# Altium schematic sheet DAC To LP Filter.SchDoc: Audio_Moduloop - DAC/LP-filter
size A; Date: 2/27/2024; DrawnBy: Team 28: Ryan Gordon, Conor Curtin, Evan Roveili, Shawn Colby; DocumentNumber: 3; Revision: V1; SheetNumber: 3; SheetTotal: 7
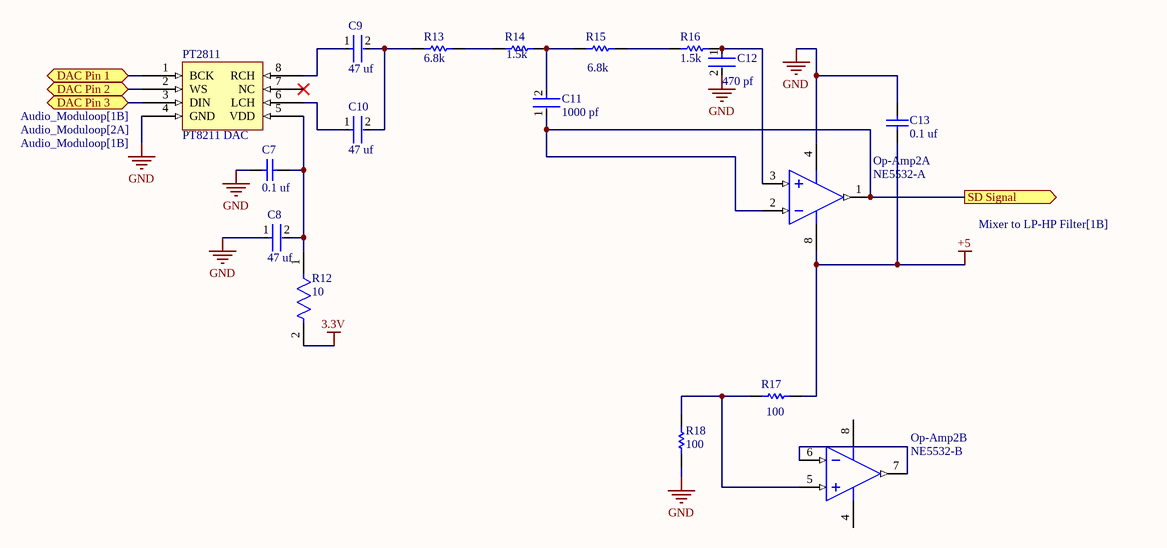
[diagram p0: DAC To LP Filter.SchDoc]

## Parts
C7  0.1 uf  [VISH-K104K15X7RF5TL2]
C8  47 uf  [FP-RCE2A2-MFG]
C9  47 uf  [FP-RCE2A2-MFG]
C10  47 uf  [FP-RCE2A2-MFG]
C11  1000 pf  [FP-VY1102M35Y5UQ6TV0-MFG]
C12  470 pf  [FP-F471K33Y5RP6UK5R-MFG]
C13  0.1 uf  [AVX-SA115C104KAR]
Op-Amp2  NE5532-A  [ONSC-SOIC-8-751-07_V]  (parts A,B of 2)
PT2811  PT8211 DAC  [SOIC127P602X173-8N]
R12  10  [FP-RN732A-MFG]
R13  6.8k  [RESC2013X70X40LL20T20]
R14  1.5k  [RESC2013X60X35LL10T20]
R15  6.8k  [RESC2013X70X40LL20T20]
R16  1.5k  [RESC2013X60X35LL10T20]
R17  100  [RESC2013X60X40ML20T25]
R18  100  [RESC2013X60X40ML20T25]

## Ports
DAC Pin 1 (bidir, see Audio_Moduloop[1B]), DAC Pin 2 (bidir, see Audio_Moduloop[1B]), DAC Pin 3 (bidir, see Audio_Moduloop[2A]), SD Signal (out, see Mixer to LP-HP Filter[1B])

## Nets
3.3V: R12.2
+5: C13.1 Op-Amp2.8(V+) R17.2
GND: C7.2 C8.1 C12.2 C13.2 Op-Amp2.4(V-) PT2811.4(GND) R18.1
DAC Pin 1: PT2811.1(BCK) ; port DAC Pin 1
DAC Pin 2: PT2811.2(WS) ; port DAC Pin 2
DAC Pin 3: PT2811.3(DIN) ; port DAC Pin 3
SD Signal: C11.1 Op-Amp2.1(OUTA) Op-Amp2.2(INA-) ; port SD Signal
NetC7_1: C7.1 C8.2 PT2811.5(VDD) R12.1
NetC9_1: C9.1 PT2811.8(RCH)
NetC9_2: C9.2 C10.2 R13.1
NetC10_1: C10.1 PT2811.6(LCH)
NetC11_2: C11.2 R14.2 R15.1
NetC12_1: C12.1 Op-Amp2.3(INA+) R16.2
NetOp-Amp2_5: Op-Amp2.5(INB+) R17.1 R18.2
NetOp-Amp2_6: Op-Amp2.6(INB-) Op-Amp2.7(OUTB)
NetR13_2: R13.2 R14.1
NetR15_2: R15.2 R16.1

Not connected (* = marked no-connect by the designer): PT2811 7(NC)*

## Notes on the sheet
- Title
- Size
- Date:
- A
- Drawn By:
- Sheet    of
- Revision
- File:
- Document Number:

## Library data of the parts
C7 = CMP-2000-06508-1: Ceramic Capacitor, 100 nF, +/- 10%, 50 V, -55 to 125 degC, 2-Pin THD, RoHS, Tape and Reel; Manufacturer: Vishay; Other Names: BC1084CT; Catalog Drawings: Mono-KapSide2-15_5.58Mono-KapSide1_15; Temperature Coefficient: X7R; Voltage - Rated: 50V; Online Catalog: Mono-Kap™Series; Capacitance: 0.1µF; Size / Dimension: 0.157"Lx0.098"W(4.00mmx2.50mm); Operating Temperature: -55°C~125°C; Family: CeramicCapacitors; Manufacturer URL: http://www.vishay.com/; Standard Package: 1; Thickness (Max): -; Ratings: -; Datasheet Version: 08/2013; Package Description: 2-Pin Through Hole Device, Body 4 x 2.6 mm; Mounting Type: ThroughHole; Features: -; Lead Spacing: 0.098"(2.50mm); Tolerance: ±10%; Category: Capacitors; Mounting Technology: ThroughHole; Lead Style: Straight; Datasheet URL: http://www.vishay.com/docs/45171/kseries.pdf; Applications: GeneralPurpose; Package / Case: Radial; Height - Seated (Max): 0.220"(5.58mm); Package Reference: K104K15X7RF5TL2; Series: Mono-Kap™K; Packaging: CutTape(CT)
C8-C10 = CMP-06035-022497-1: Cap Ceramic 4.7uF 25V X7R ±10% Radial 2.5mm +125°C Automotive Ammo Pack; Lead/Base Style: Straight; Lead Diameter: 0.5mm; Height - Seated (Max): 0.157inch; Voltage Rating (DC): 25V; Height: 4mm; Length: 0.217inch; Max Operating Temperature: 125°C; Ratings: AEC-Q200; Dielectric: X7R; Resistor Type: Ceramic; Packaging: Tape and Reel; Tolerance: 10%; Termination: Radial; Min Operating Temperature: -55°C; Case/Package: Radial; Width: 0.124inch; Lead Pitch: 0.098inch; Package Quantity: 2000; Voltage Rating: 25V; Mount: Through Hole; Capacitance: 4.7uF
C11 = CMP-02417-000063-1: CAP CER 1000PF 760VAC Y5U RADIAL; Voltage: 500V; Capacitance: 1nF; Lead Diameter: 0.6mm; Lead/Base Style: Kinked; Tolerance: 20%; Construction: RADIAL; Dielectric: Y5U; RoHS Compliant: Yes; Resistor Type: Ceramic; Min Operating Temperature: -40°C; Height - Seated (Max): 0.512inch; Series: VY1; Diameter: 9mm; Voltage Rating (AC): 500V; Termination: Radial; Depth: 5mm; Radiation Hardening: No; Lead Pitch: 10mm; Package Quantity: 500; Case/Package: Radial; Height: 12mm; Contact Plating: Tin; Voltage Rating (DC): 500V; Max Operating Temperature: 125°C; Packaging: Tape and Reel; Mount: Through Hole
C12 = CMP-02417-000080-1: CAP CER 470PF 2KV Y5R RADIAL; Tolerance: 10%; Dielectric Material: Ceramic; Insulation Resistance: 10GR; Lead/Base Style: Kinked; Lead Diameter: 0.8mm; Series: F; Depth: 5mm; Package Quantity: 1500; Resistor Type: Ceramic; Construction: RADIAL; Min Operating Temperature: -30°C; Mount: Through Hole; Radiation Hardening: No; Voltage: 2kV; Voltage Rating: 2kV; Max Operating Temperature: 125°C; Termination: Radial; RoHS Compliant: Yes; Lead Pitch: 5mm; Capacitance: 470pF; Packaging: Tape and Reel; Length: 8.5mm; Case/Package: Radial; Dielectric: Y5R
C13 = CMP-2000-07029-1: Axial Leads / SpinGuard(R), Ceramic Capacitor, 0.10 uF +/- 10%, 50V, -55 to 125 degC, 2-Pin THD, RoHS, Tape and Reel; Manufacturer: AVX; Other Names: 478-3151-1; Catalog Drawings: SASeries_4.32x3.05; Capacitance: 0.1µF; Temperature Coefficient: X7R; Online Catalog: SpinGuard®SASeries; Product Training Modules: ComponentSolutionsforSmartMeterApplications; Category: Capacitors; Package Description: 2-Pin Axial Lead, Dia 3.05 mm, Body Length 4.32 mm; Standard Package: 1; Mounting Technology: ThroughHole; Ratings: -; Datasheet Version: 06/2007; Voltage - Rated: 50V; Tolerance: ±10%; Package Reference: SA115C104KAR; Packaging: -; Lead Style: -; Size / Dimension: 0.120"Diax0.170"L(3.05mmx4.32mm); Mounting Type: ThroughHole; Operating Temperature: -55°C~125°C; Datasheet URL: https://datasheet.ciiva.com/27051/1074183-27051369.pdf; Applications: GeneralPurpose; Thickness (Max): -; Lead Spacing: -; Height - Seated (Max): -; Family: CeramicCapacitors; Package / Case: Axial; Features: -; Series: SpinGuard®SA; Manufacturer URL: http://www.avx.com/
Op-Amp2 = CMP-1310-00252-1: Internally Compensated Dual Low Noise Operational Amplifier, 6 to 40 V, 0 to 70 degC, 8-Pin SOIC, Pb-Free, Tape and Reel; Manufacturer: On Semiconductor; PartNumber: NE5532AD8R2G; SR Typ (V/uS): 9; VCC Min (V): 6; VCC Max (V): 40; GBW Typ (MHz): 10; PackageVersion: Rev. AK, 02/2011; ComponentLink2URL: http://www.onsemi.cn/pub_link/Collateral/NE5532-D.PDF; RoHS: TRUE; PackageReference: SOIC-8-751-07; ComponentLink2Description: Datasheet; PackageDescription: 8-Pin Small Outline Integrated Circuit, Body 4.9 x 3.9 mm, Pitch 1.27 mm; ComponentLink3URL: http://www.onsemi.com/pub_link/Collateral/751-07.PDF; ComponentLink1Description: Manufacturer URL; DatasheetVersion: Rev. 2; Packing: Tape and Reel; ComponentLink1URL: http://www.onsemi.com/; ComponentLink3Description: Package Specification; Mounting Technology: Surface Mount
PT2811 = CMP-015-00008-3
R12 = CMP-03211-004731-1: SMD Chip Resistor, Thin Film, 10Ω, 100 V, 0805 [2012 Metric], 100 mW, 0.1%, RN73 Series; Manufacturer: TE Connectivity; Manufacturer Part Number: RN73C2A10RBTG; Power Rating: 0.1W; Temperature Coefficient: 10ppm/°C; Voltage Rating: 100V; Device Class L2: Resistors; octopart_url: https://octopart.com/rn73c2a10rbtg-te+connectivity-21412009; Temperature: -55°C to 155°C; Automotive: No; Temperature Range High: 155°C; Device Class L1: Passive Components; Package: RN732A; Value: 10Ω; Lead Free: Yes; Composition: Thin Film; Ipc Land Pattern Name: RESC200125X55; Resistance: 10Ω; RoHS: TRUE; Height: 0.65mm; Series: RN73; Category: Res; ComponentLink2URL: https://www.te.com/commerce/DocumentDelivery/DDEController?Action=showdoc&DocId=Data+Sheet%7F1773270%7FP%7Fpdf%7FEnglish%7FENG_DS_1773270_P.pdf%7F1676162-2; Device Class L3: Chip SMD Resistors; Octopart: https://octopart.com/rn73c2a10rbtg-te+connectivity-21412009; ComponentLink2Description: Datasheet; Temperature Range Low: -55°C; packaging: 250 cut tape length; Tolerance: 0.1%
R13 R15 = CMP-2001-00567-1: Manufacturer: Panasonic; Part Number: ERJ6ENF6801V
R14 R16 = CMP-1659-00010-2: RES 1.50K OHM 1/8W 1% 0805 SMD; Manufacturer: Yageo; PartNumber: RC0805FR-071K5L; PackageReference: 0805; ComponentLink1URL: http://www.yageo.com/documents/recent/PYu-RC_Group_51_RoHS_L_04.pdf; ComponentLink1Description: Datasheet
R17 R18 = CMP-2001-00580-1: Manufacturer: Panasonic; Part Number: ERA6AEB101V